# Altium schematic sheet Main PCB.SchDoc
size A; SheetNumber: 1; SheetTotal: 1
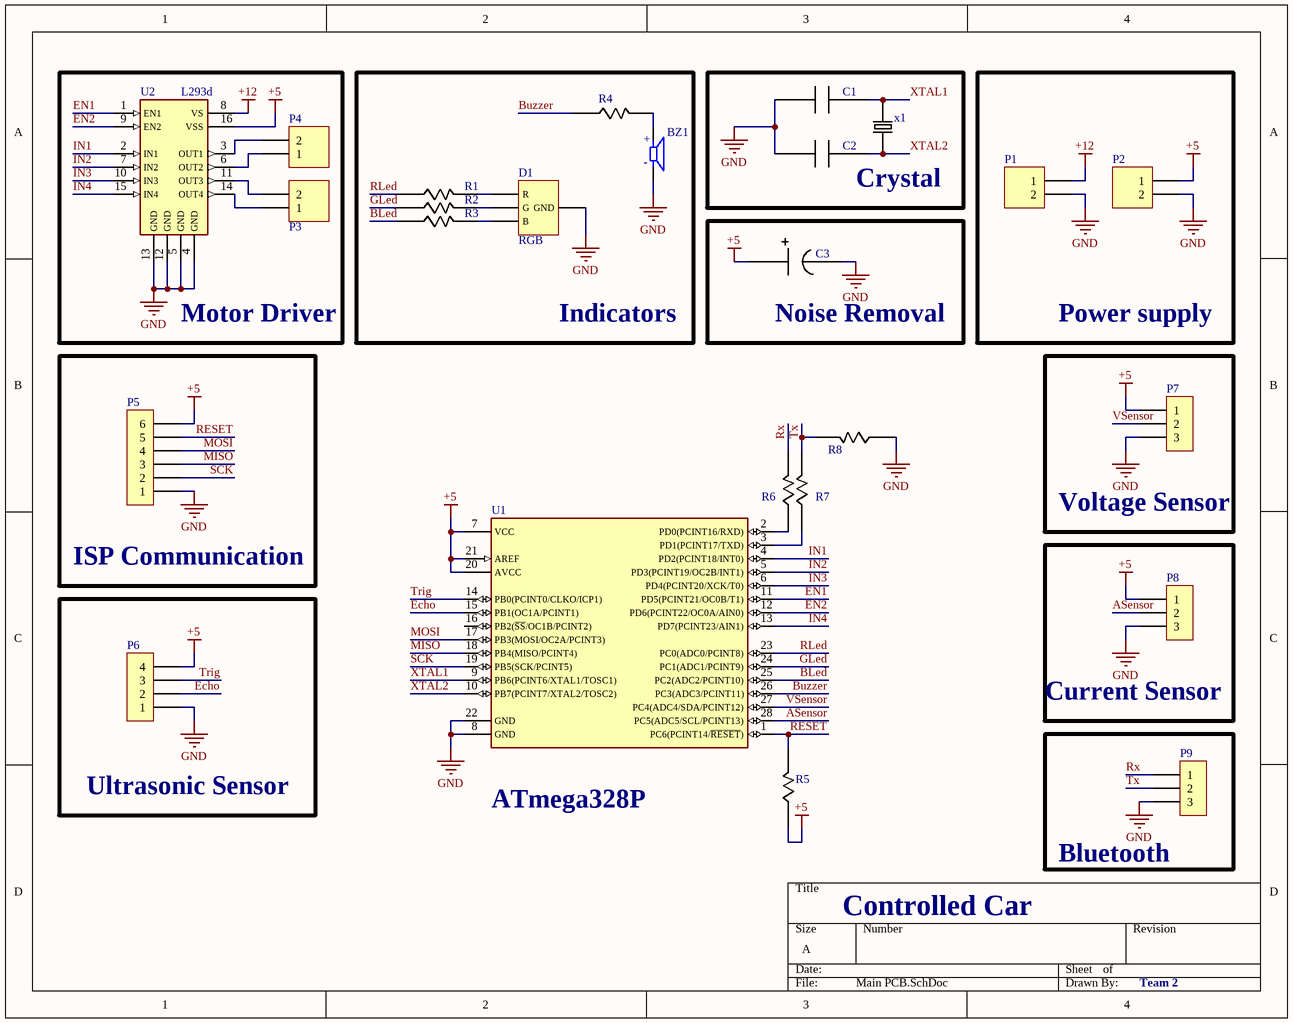
[diagram p0: Main PCB.SchDoc]

## Parts
BZ1  BUZZER  [BUZZER]  (value not drawn)
C1  Capacitor  [CAPACITOR]  (value not drawn)
C2  Capacitor  [CAPACITOR]  (value not drawn)
C3  Polarized cap  [POL CAP]  (value not drawn)
D1  RGB  [RGB]
P1  Terminal block  [TERMINAL BLOCK]  (value not drawn)
P2  Terminal block  [TERMINAL BLOCK]  (value not drawn)
P3  Terminal block  [TERMINAL BLOCK]  (value not drawn)
P4  Terminal block  [TERMINAL BLOCK]  (value not drawn)
P5  6 pins  [6 Pins connector]  (value not drawn)
P6  4 pins  [4 pins connector]  (value not drawn)
P7  3 pins  [3 pins connector]  (value not drawn)
P8  3 pins  [3 pins connector]  (value not drawn)
P9  3 pins  [3 pins connector]  (value not drawn)
R1  Resistor  [RESISTOR]  (value not drawn)
R2  Resistor  [RESISTOR]  (value not drawn)
R3  Resistor  [RESISTOR]  (value not drawn)
R4  Resistor  [RESISTOR]  (value not drawn)
R5  Resistor  [RESISTOR]  (value not drawn)
R6  Resistor  [RESISTOR]  (value not drawn)
R7  Resistor  [RESISTOR]  (value not drawn)
R8  Resistor  [RESISTOR]  (value not drawn)
U1  ATmega328P  [ATmega328P]
U2  L293d  [L293d]
x1  Crystal  [CRYSTAL]  (value not drawn)

## Blocks framed on the sheet
Motor Driver: P3 P4 U2
Indicators: BZ1 D1 R1-R4
Crystal: C1 C2 x1
Power supply: P1 P2
Noise Removal: C3
ISP Communication: P5
Voltage Sensor: P7
Current Sensor: P8
Ultrasonic Sensor: P6
Bluetooth: P9

## Nets
+5: C3.1 P2.1 P5.6 P6.4 P7.1 P8.1 R5.1 U1.7(VCC) U1.20(AVCC) U1.21(AREF) U2.16(VSS)
+12: P1.1 U2.8(VS)
GND: BZ1.M C1.1 C2.1 C3.2 D1.2(GND) P1.2 P2.2 P5.1 P6.1 P7.3 P8.3 P9.3 R8.1 U1.8(GND) U1.22(GND) U2.4(GND) U2.5(GND) U2.12(GND) U2.13(GND)
ASensor: P8.2 U1.28(PC5(ADC5/SCL/PCINT13))
BLed: R3.1 U1.25(PC2(ADC2/PCINT10))
Buzzer: R4.1 U1.26(PC3(ADC3/PCINT11))
Echo: P6.2 U1.15(PB1(OC1A/PCINT1))
EN1: U1.11(PD5(PCINT21/OC0B/T1)) U2.1(EN1)
EN2: U1.12(PD6(PCINT22/OC0A/AIN0)) U2.9(EN2)
GLed: R2.1 U1.24(PC1(ADC1/PCINT9))
IN1: U1.4(PD2(PCINT18/INT0)) U2.2(IN1)
IN2: U1.5(PD3(PCINT19/OC2B/INT1)) U2.7(IN2)
IN3: U1.6(PD4(PCINT20/XCK/T0)) U2.10(IN3)
IN4: U1.13(PD7(PCINT23/AIN1)) U2.15(IN4)
MISO: P5.3 U1.18(PB4(MISO/PCINT4))
MOSI: P5.4 U1.17(PB3(MOSI/OC2A/PCINT3))
RESET: P5.5 R5.2 U1.1(PC6(PCINT14/~{RESET}))
RLed: R1.1 U1.23(PC0(ADC0/PCINT8))
Rx: P9.1 R6.2
SCK: P5.2 U1.19(PB5(SCK/PCINT5))
Trig: P6.3 U1.14(PB0(PCINT0/CLKO/ICP1))
Tx: P9.2 R7.2 R8.2
VSensor: P7.2 U1.27(PC4(ADC4/SDA/PCINT12))
XTAL1: C1.2 U1.9(PB6(PCINT6/XTAL1/TOSC1)) x1.2
XTAL2: C2.2 U1.10(PB7(PCINT7/XTAL2/TOSC2)) x1.1
NetBZ1_P: BZ1.P R4.2
NetD1_1: D1.1(R) R1.2
NetD1_3: D1.3(G) R2.2
NetD1_4: D1.4(B) R3.2
NetP3_1: P3.1 U2.14(OUT4)
NetP3_2: P3.2 U2.11(OUT3)
NetP4_1: P4.1 U2.6(OUT2)
NetP4_2: P4.2 U2.3(OUT1)
NetR6_1: R6.1 U1.2(PD0(PCINT16/RXD))
NetR7_1: R7.1 U1.3(PD1(PCINT17/TXD))

Not connected (* = marked no-connect by the designer): U1 16(PB2(~{SS}/OC1B/PCINT2))

## Notes on the sheet
- Controlled Car
- Team 2
- (in symbol BUZZER) +; -